# Altium schematic sheet 12 RGB LCD.SchDoc
size 420 x 297 mm; Organization: Altium Limited; Address1: L3, 12a Rodborough Rd; Address2: Frenchs Forest; Address3: NSW; Address4: Australia 2086
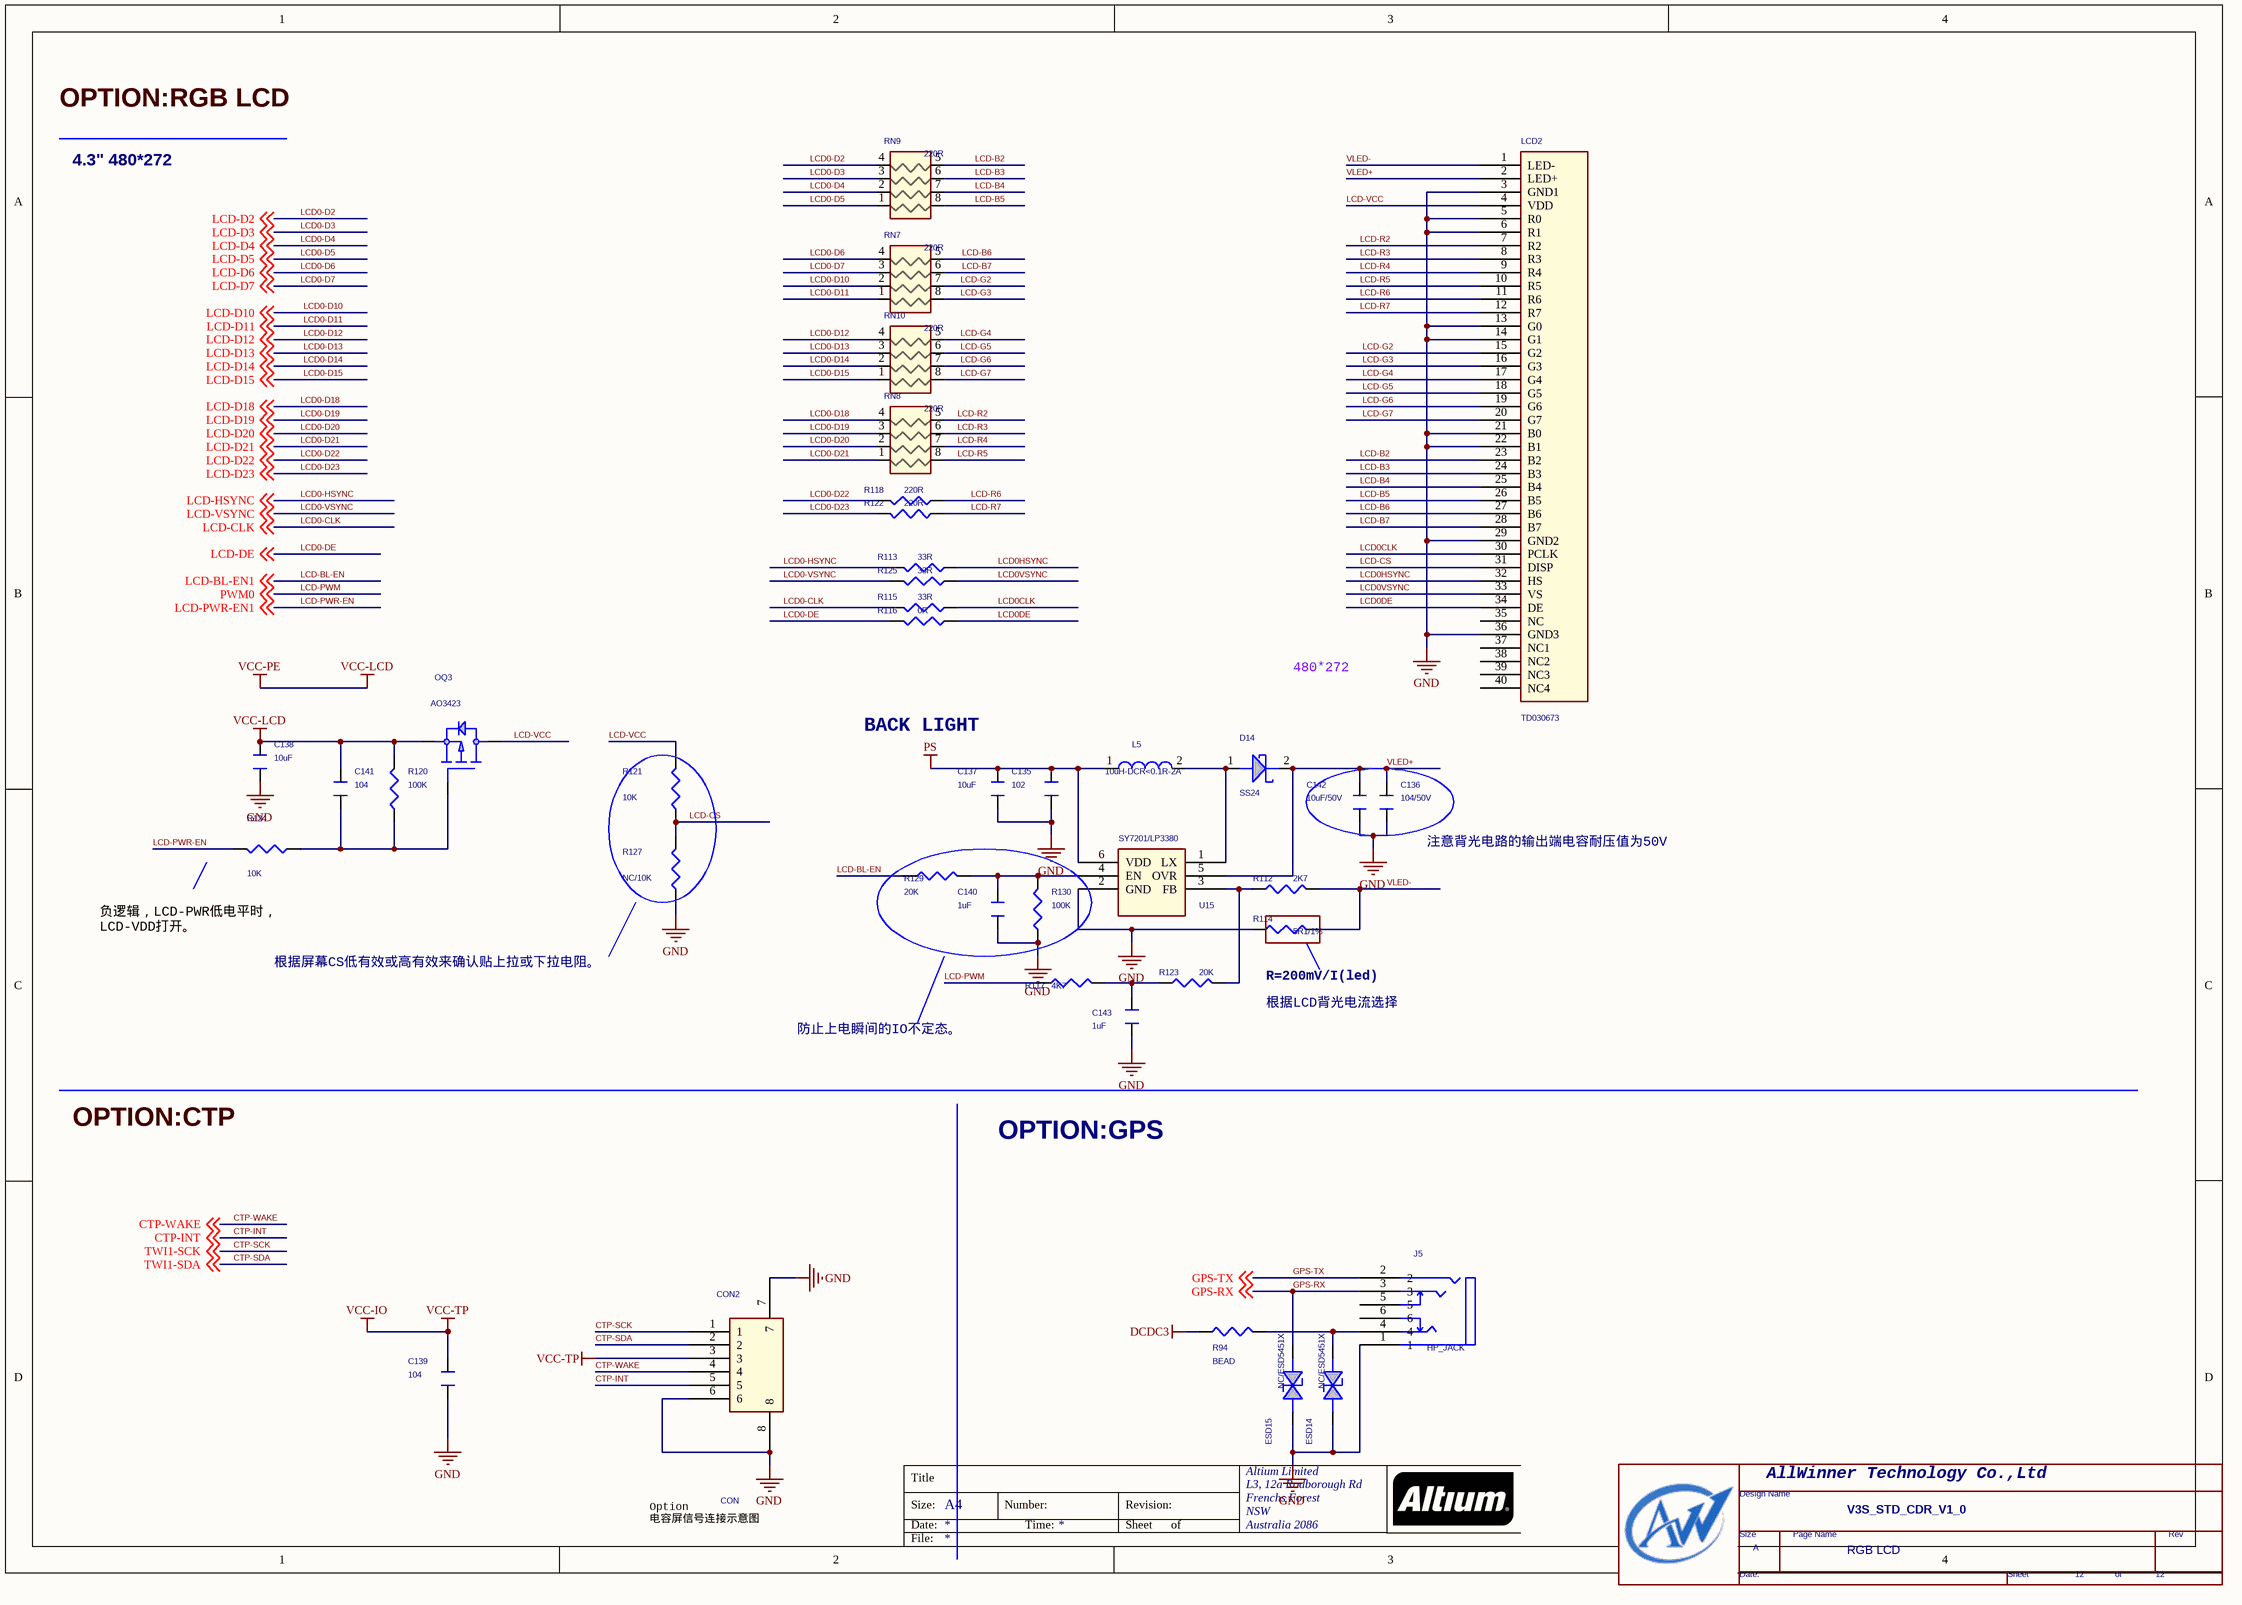
[diagram p0: 12 RGB LCD.SchDoc]

## Parts
*  Page Count: 12  Page Size: A  Title: V3S_STD_CDR_V1_0  Doc: RGB LCD  (hidden comment: TitleBlock0-AW)  (graphical)
C135  102  [C0402]
C136  104/50V  [C0603]
C137  10uF  [C0603]
C138  10uF  [C0603]
C139  104  [C0402]
C140  1uF  [C0402]
C141  104  [C0402]
C142  10uF/50V  [C0805]
C143  1uF  [C0402]
CON2  CON  [SOT23-6]
D14  SS24  [SOD123]
ESD14  NC/ESD5451X  [ESD9B5V]
ESD15  NC/ESD5451X  [ESD9B5V]
J5  HP_JACK  [EAR-JACK-3-5]
L5  10uH-DCR<0.1R-2A  [CD43]
LCD2  TD030673  [CON40]
OQ3  AO3423  [SOT-23]
R94  BEAD  [R0603]
R112  2K7  [R0402]
R113  33R  [R0402]
R114  5R1/1%  [R0402]
R115  33R  [R0402]
R116  0R  [R0402]
R117  4K7  [R0402]
R118  220R  [R0402]
R120  100K  [R0402]
R121  10K  [R0402]
R122  220R  [R0402]
R123  20K  [R0402]
R124  10K  [R0402]
R125  33R  [R0402]
R127  NC/10K  [R0402]
R129  20K  [R0402]
R130  100K  [R0402]
RN7  220R  [RCA50-8]
RN8  220R  [RCA50-8]
RN9  220R  [RCA50-8]
RN10  220R  [RCA50-8]
U15  SY7201/LP3380  [SOT23-6]

## Nets
DCDC3: R94.1
GND: C135.1 C136.1 C137.1 C138.1 C139.1 C140.1 C142.1 C143.1 CON2.6 CON2.7 CON2.8 ESD14.2(CATHODE) ESD15.2(CATHODE) J5.1 LCD2.3(GND1) LCD2.5(R0) LCD2.6(R1) LCD2.13(G0) LCD2.14(G1) LCD2.21(B0) LCD2.22(B1) LCD2.29(GND2) LCD2.36(GND3) R114.2 R127.2 R130.1 U15.2(GND)
PS: C135.2 C137.2 L5.1 U15.6(VDD)
VCC-IO: C139.2 CON2.3  [also labelled VCC-TP]
VCC-LCD: C138.2 C141.2 OQ3.2(SOURCE) R120.2  [also labelled VCC-PE]
CTP-INT: CON2.5 ; off-sheet CTP-INT
CTP-SCK: CON2.1 ; off-sheet TWI1-SCK  [also labelled TWI1-SCK]
CTP-SDA: CON2.2 ; off-sheet TWI1-SDA  [also labelled TWI1-SDA]
CTP-WAKE: CON2.4 ; off-sheet CTP-WAKE
GPS-RX: ESD15.1(ANODE) J5.3 ; off-sheet GPS-RX
GPS-TX: J5.2 ; off-sheet GPS-TX
LCD0-CLK: R115.2 ; off-sheet LCD-CLK  [also labelled LCD-CLK]
LCD0-D2: RN9.4 ; off-sheet LCD-D2  [also labelled LCD-D2]
LCD0-D3: RN9.3 ; off-sheet LCD-D3  [also labelled LCD-D3]
LCD0-D4: RN9.2 ; off-sheet LCD-D4  [also labelled LCD-D4]
LCD0-D5: RN9.1 ; off-sheet LCD-D5  [also labelled LCD-D5]
LCD0-D6: RN7.4 ; off-sheet LCD-D6  [also labelled LCD-D6]
LCD0-D7: RN7.3 ; off-sheet LCD-D7  [also labelled LCD-D7]
LCD0-D10: RN7.2 ; off-sheet LCD-D10  [also labelled LCD-D10]
LCD0-D11: RN7.1 ; off-sheet LCD-D11  [also labelled LCD-D11]
LCD0-D12: RN10.4 ; off-sheet LCD-D12  [also labelled LCD-D12]
LCD0-D13: RN10.3 ; off-sheet LCD-D13  [also labelled LCD-D13]
LCD0-D14: RN10.2 ; off-sheet LCD-D14  [also labelled LCD-D14]
LCD0-D15: RN10.1 ; off-sheet LCD-D15  [also labelled LCD-D15]
LCD0-D18: RN8.4 ; off-sheet LCD-D18  [also labelled LCD-D18]
LCD0-D19: RN8.3 ; off-sheet LCD-D19  [also labelled LCD-D19]
LCD0-D20: RN8.2 ; off-sheet LCD-D20  [also labelled LCD-D20]
LCD0-D21: RN8.1 ; off-sheet LCD-D21  [also labelled LCD-D21]
LCD0-D22: R118.2 ; off-sheet LCD-D22  [also labelled LCD-D22]
LCD0-D23: R122.2 ; off-sheet LCD-D23  [also labelled LCD-D23]
LCD0-DE: R116.2 ; off-sheet LCD-DE  [also labelled LCD-DE]
LCD0-HSYNC: R113.2 ; off-sheet LCD-HSYNC  [also labelled LCD-HSYNC]
LCD0-VSYNC: R125.2 ; off-sheet LCD-VSYNC  [also labelled LCD-VSYNC]
LCD0CLK: LCD2.30(PCLK) R115.1
LCD0DE: LCD2.34(DE) R116.1
LCD0HSYNC: LCD2.32(HS) R113.1
LCD0VSYNC: LCD2.33(VS) R125.1
LCD-B2: LCD2.23(B2) RN9.5
LCD-B3: LCD2.24(B3) RN9.6
LCD-B4: LCD2.25(B4) RN9.7
LCD-B5: LCD2.26(B5) RN9.8
LCD-B6: LCD2.27(B6) RN7.5
LCD-B7: LCD2.28(B7) RN7.6
LCD-BL-EN: R129.1 ; off-sheet LCD-BL-EN1  [also labelled LCD-BL-EN1]
LCD-CS: LCD2.31(DISP) R121.2 R127.1
LCD-G2: LCD2.15(G2) RN7.7
LCD-G3: LCD2.16(G3) RN7.8
LCD-G4: LCD2.17(G4) RN10.5
LCD-G5: LCD2.18(G5) RN10.6
LCD-G6: LCD2.19(G6) RN10.7
LCD-G7: LCD2.20(G7) RN10.8
LCD-PWM: R117.1 ; off-sheet PWM0  [also labelled PWM0]
LCD-PWR-EN: R124.2 ; off-sheet LCD-PWR-EN1  [also labelled LCD-PWR-EN1]
LCD-R2: LCD2.7(R2) RN8.5
LCD-R3: LCD2.8(R3) RN8.6
LCD-R4: LCD2.9(R4) RN8.7
LCD-R5: LCD2.10(R5) RN8.8
LCD-R6: LCD2.11(R6) R118.1
LCD-R7: LCD2.12(R7) R122.1
LCD-VCC: LCD2.4(VDD) OQ3.3(DRAIN) R121.1
VLED+: C136.2 C142.2 D14.2 LCD2.2(LED+) U15.5(OVR)
VLED-: LCD2.1(LED-) R112.2 R114.1
NetC140_2: C140.2 R129.2 R130.2 U15.4(EN)
NetC141_1: C141.1 OQ3.1(GATE) R120.1 R124.1
NetC143_2: C143.2 R117.2 R123.1
NetD14_1: D14.1 L5.2 U15.1(LX)
NetESD14_1: ESD14.1(ANODE) J5.4 R94.2
NetR112_1: R112.1 R123.2 U15.3(FB)

Not connected (* = marked no-connect by the designer): J5 5 6; LCD2 35(NC) 37(NC1) 38(NC2) 39(NC3) 40(NC4)

## Notes on the sheet
- OPTION:RGB LCD
- 4.3" 480*272
- 480*272
- BACK LIGHT
- 注意背光电路的输出端电容耐压值为50V
- 负逻辑，LCD-PWR低电平时，
  LCD-VDD打开。
- 根据屏幕CS低有效或高有效来确认贴上拉或下拉电阻。
- R=200mV/I(led)
- 防止上电瞬间的IO不定态。
- 根据LCD背光电流选择
- OPTION:CTP
- OPTION:GPS
- Option
  电容屏信号连接示意图
- Title
- Size:
- Date:
- A4
- Number:
- Time:
- Revision:
- Sheet
- of
- File:
- (in symbol TitleBlock0-AW) AllWinner Technology Co.,Ltd; Design Name; Size; Page Name; Rev; Date:; Sheet; of

## Library data of the parts
* = TitleBlock0-AW: RevCode: 0.1; Page Number: 12; Page Create Date: March  8, 1995
C135 C137 C143 = CAPACITOR_0_Dup5: mypage: 09; Page: 10
C136 C140 C142 = CAPACITOR_0_Dup5: Page: 10; mypage: 09
C138 C141 = CAPACITOR_Dup1: Page: 10
C139 = CAPACITOR_0_Dup5: PAGE: 2
CON2 = RT9266PE_0
D14 = DIODE SCHOTTKY: RoHS 1.0 Ampere Schottky Barrier Rectifiers  SOD-123; Page: 10
ESD14 ESD15 = 1_1.5KE100A: 1ST PART DESCRIPTION: WILL ESD9B5V Bidirection ESD Protection; Page: 11
J5 = USB_WIFI_0
L5 = INDUCTOR: RoHS Power Inductor 22uH 300mA H<1.8MM,CD32; mypage: 09; Page: 10
LCD2 = TD030673_0: Page: 10
OQ3 = PMOS: Page: 10
R94 = R: Part Description: Chip Resistor
R112 R114 R117 R123 = RESISTOR_Dup2: mypage: 09; Page: 10
R113 R115 R116 R118 R122 R125 = R_Dup4: Page: 10
R120 R124 = R_Dup3: Page: 10
R121 R127 = RESISTOR_5: Page: 10
R129 R130 = RESISTOR_Dup2: Page: 10; mypage: 09
RN7-RN10 = 742C083/SM_0: Page: 10
U15 = AP3031: Page: 10